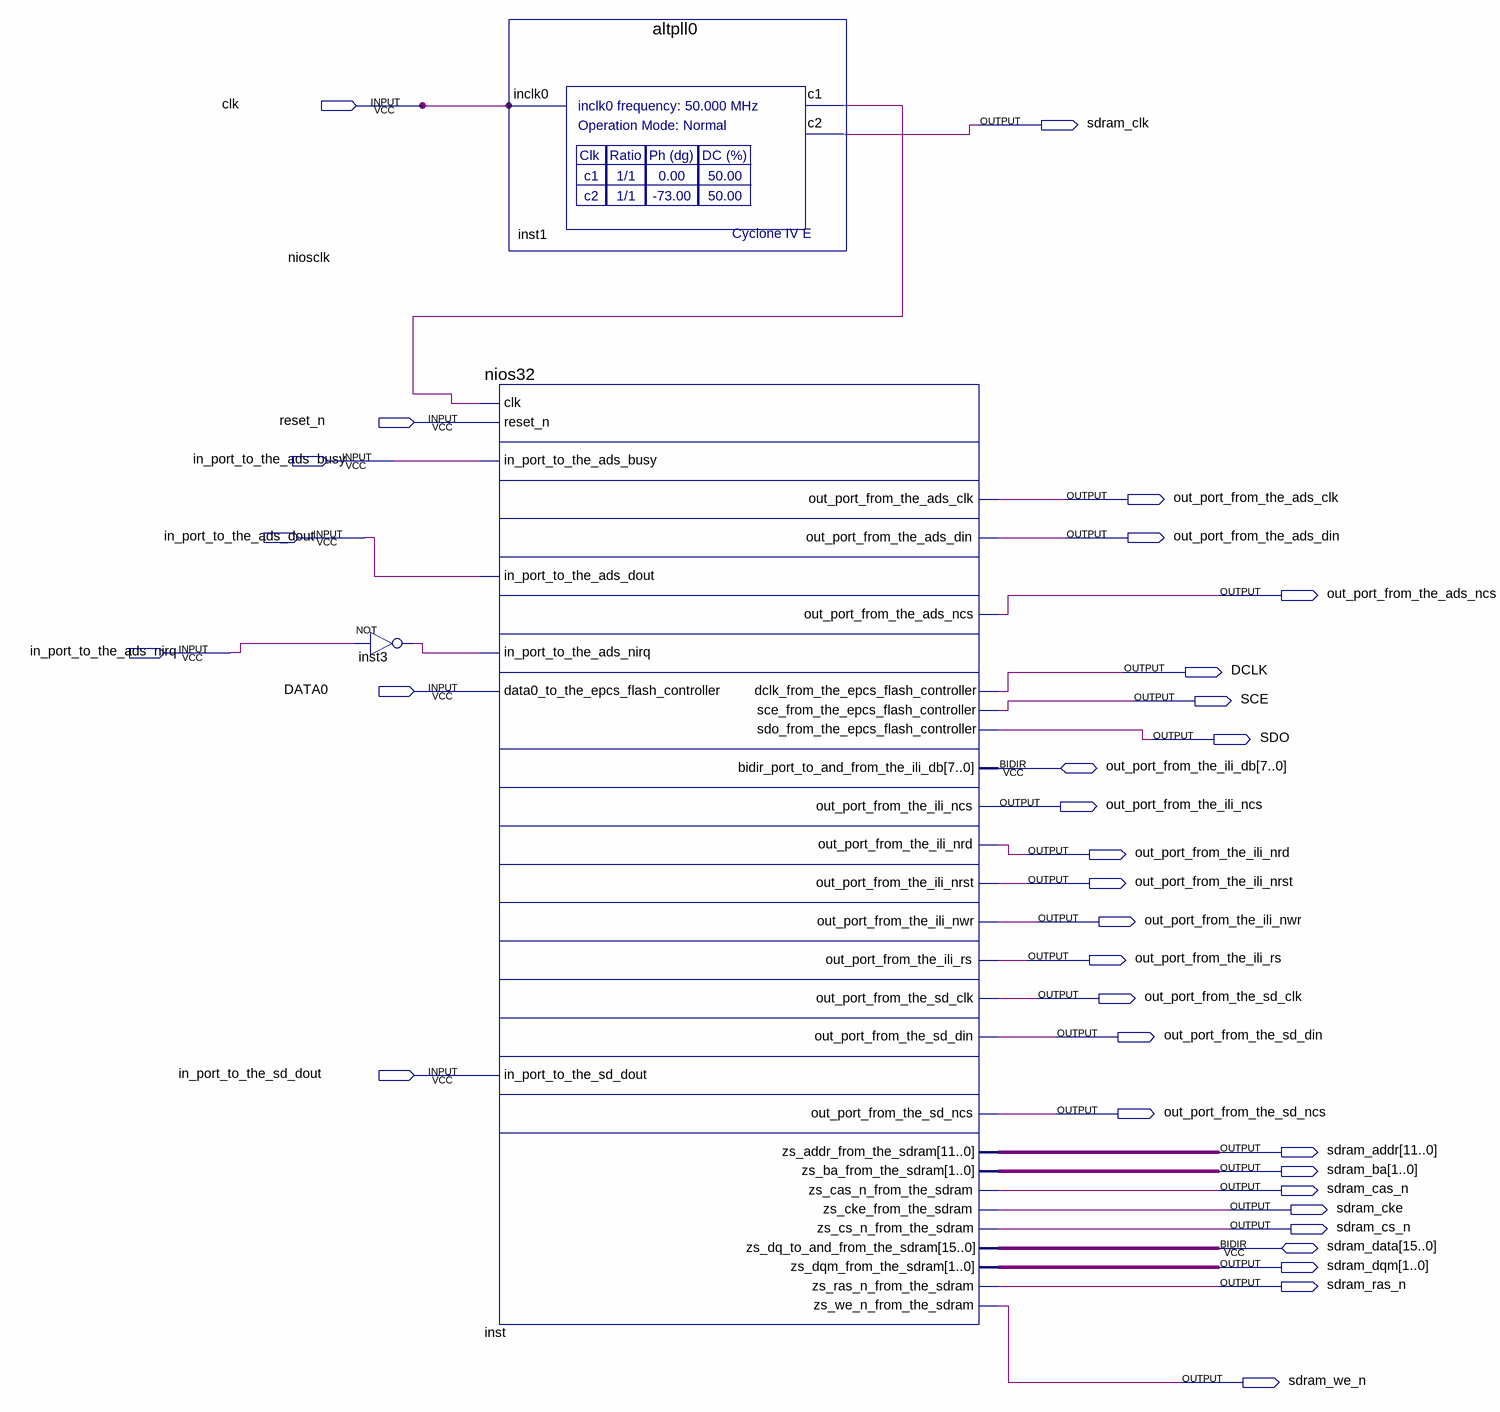
[diagram p0: schematic sheet]
// Quartus schematic nios2.bdf as structural Verilog: 3 symbols, 32 pins
module nios2 (
  input  clk,
  input  reset_n,
  input  in_port_to_the_ads_busy,
  input  in_port_to_the_ads_dout,
  input  in_port_to_the_ads_nirq,
  input  DATA0,
  input  in_port_to_the_sd_dout,
  inout  [7:0] out_port_from_the_ili_db,
  inout  [15:0] sdram_data,
  output sdram_clk,
  output out_port_from_the_ads_clk,
  output out_port_from_the_ads_din,
  output out_port_from_the_ads_ncs,
  output DCLK,
  output SCE,
  output SDO,
  output out_port_from_the_ili_ncs,
  output out_port_from_the_ili_nrd,
  output out_port_from_the_ili_nrst,
  output out_port_from_the_ili_nwr,
  output out_port_from_the_ili_rs,
  output out_port_from_the_sd_clk,
  output out_port_from_the_sd_din,
  output out_port_from_the_sd_ncs,
  output [11:0] sdram_addr,
  output [1:0] sdram_ba,
  output sdram_cas_n,
  output sdram_cke,
  output sdram_cs_n,
  output [1:0] sdram_dqm,
  output sdram_ras_n,
  output sdram_we_n
);

  wire inst3_out, niosclk;

  not inst3 (inst3_out, in_port_to_the_ads_nirq);
  nios32 inst (
    .clk(niosclk), .reset_n(reset_n), .in_port_to_the_ads_busy(in_port_to_the_ads_busy),
    .in_port_to_the_ads_dout(in_port_to_the_ads_dout), .in_port_to_the_ads_nirq(inst3_out),
    .data0_to_the_epcs_flash_controller(DATA0), .in_port_to_the_sd_dout(in_port_to_the_sd_dout),
    .out_port_from_the_ads_clk(out_port_from_the_ads_clk),
    .out_port_from_the_ads_din(out_port_from_the_ads_din),
    .out_port_from_the_ads_ncs(out_port_from_the_ads_ncs), .dclk_from_the_epcs_flash_controller(DCLK),
    .sce_from_the_epcs_flash_controller(SCE), .sdo_from_the_epcs_flash_controller(SDO),
    .out_port_from_the_ili_ncs(out_port_from_the_ili_ncs),
    .out_port_from_the_ili_nrd(out_port_from_the_ili_nrd),
    .out_port_from_the_ili_nrst(out_port_from_the_ili_nrst),
    .out_port_from_the_ili_nwr(out_port_from_the_ili_nwr),
    .out_port_from_the_ili_rs(out_port_from_the_ili_rs), .out_port_from_the_sd_clk(out_port_from_the_sd_clk),
    .out_port_from_the_sd_din(out_port_from_the_sd_din), .out_port_from_the_sd_ncs(out_port_from_the_sd_ncs),
    .zs_addr_from_the_sdram(sdram_addr), .zs_ba_from_the_sdram(sdram_ba),
    .zs_cas_n_from_the_sdram(sdram_cas_n), .zs_cke_from_the_sdram(sdram_cke),
    .zs_cs_n_from_the_sdram(sdram_cs_n), .zs_dqm_from_the_sdram(sdram_dqm),
    .zs_ras_n_from_the_sdram(sdram_ras_n), .zs_we_n_from_the_sdram(sdram_we_n),
    .bidir_port_to_and_from_the_ili_db(out_port_from_the_ili_db), .zs_dq_to_and_from_the_sdram(sdram_data));
  altpll0 inst1 (.inclk0(clk), .c1(niosclk), .c2(sdram_clk));
endmodule
